# Altium schematic sheet floorctrl_power.SchDoc
size A
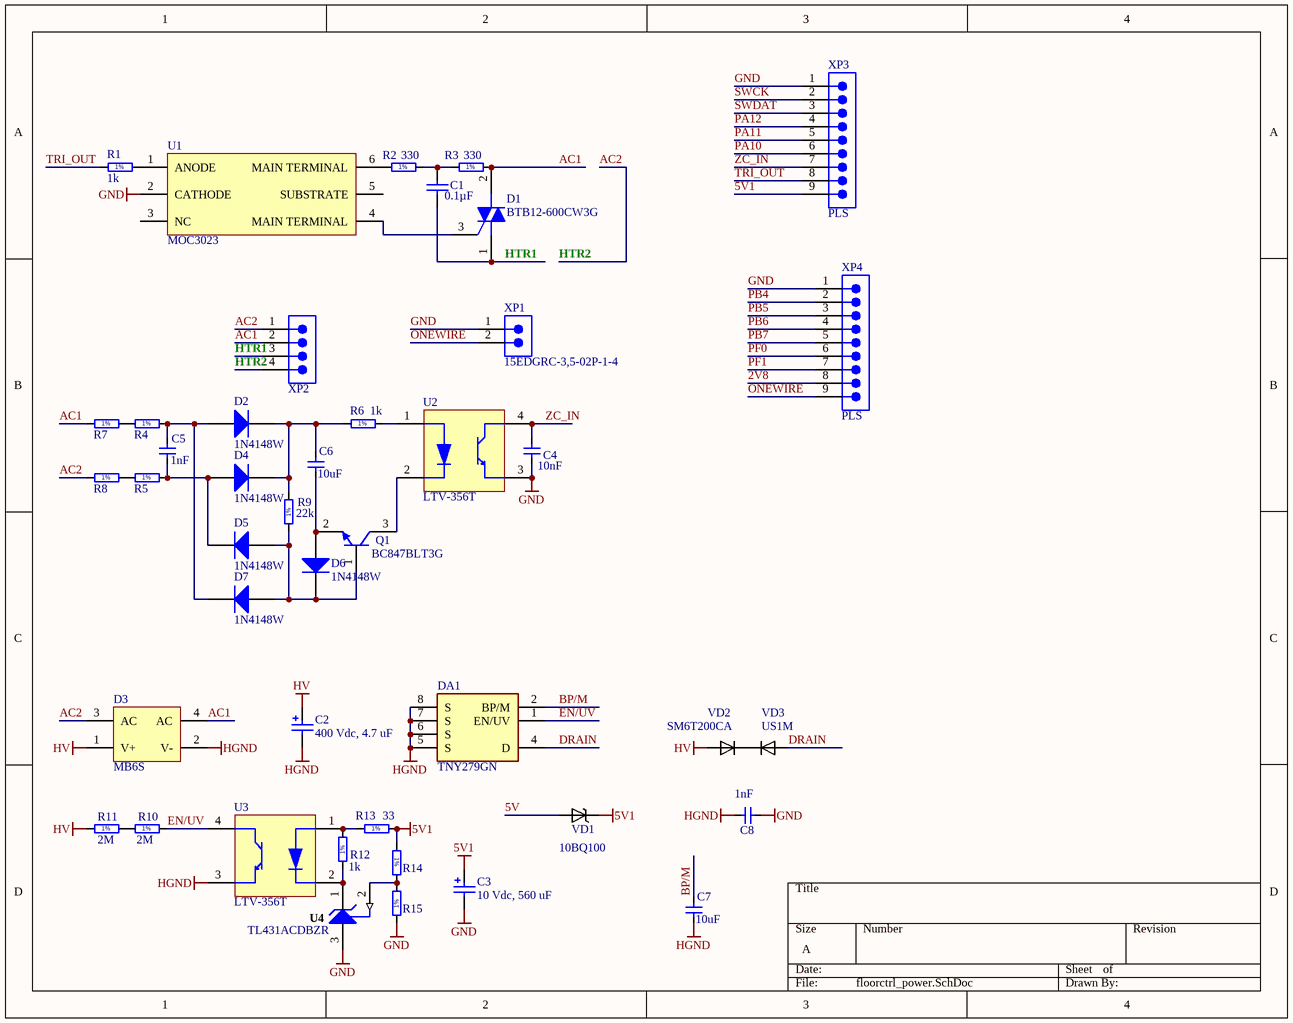
[diagram p0: floorctrl_power.SchDoc]

## Parts
C1  Capacitance: 0.1µF  [CAPA55-380X260]  (hidden comment: A104M15X7RF5TAA)
C2  400 Vdc, 4.7 uF  [WCAP-ATG8_8x11.5x3.5]
C3  10 Vdc, 560 uF  [WCAP-ATG8_8x11.5x3.5]
C4  10nF  [CAP0805R]
C5  1nF  [CAP0805R]
C6  10uF  [CAP0805R]
C7  10uF  [CAP0805R]
C8  1nF  [CAP1206R]
D1  BTB12-600CW3G  [ONSC-TO-220-3-221A-07]
D2  1N4148W  [JSCJ-SOD-123-2_V]
D3  MB6S  [FAIR-MBXS_V]
D4  1N4148W  [JSCJ-SOD-123-2_V]
D5  1N4148W  [JSCJ-SOD-123-2_V]
D6  1N4148W  [JSCJ-SOD-123-2_V]
D7  1N4148W  [JSCJ-SOD-123-2_V]
DA1  TNY279GN  [SMDIP8]
Q1  BC847BLT3G  [ONSC-SOT-23-3-318-08_V]
R1  1k  [RES0805R]
R2  330  [RES0805R]
R3  330  [RES0805R]
R4  220k  [RES1206R]  (value not drawn)
R5  220k  [RES1206R]  (value not drawn)
R6  1k  [RES0805R]
R7  220k  [RES1206R]  (value not drawn)
R8  220k  [RES1206R]  (value not drawn)
R9  22k  [RES0805R]
R10  2M  [RES1206R]
R11  2M  [RES1206R]
R12  1k  [RES0805R]
R13  33  [RES0805R]
R14  10k  [RES0805R]  (value not drawn)
R15  9k1  [RES0805R]  (value not drawn)
U1  MOC3023  [LTST-DIP-6]
U2  LTV-356T  [LTST-LTV-356T-4_V]
U3  LTV-356T  [LTST-LTV-356T-4_V]
U4  TL431ACDBZR  [DBZ0003A_L]
VD1  10BQ100  [DO-214AA]
VD2  SM6T200CA  [SMB]
VD3  US1M  [SMA]
XP1  15EDGRC-3,5-02P-1-4  [15EDGRC-3,5-02P-1-4]
XP2  15EDGRC-3.5-04P-14  [15EDGRC-3.5-04P]  (value not drawn)
XP3  PLS  [PLS-09]
XP4  PLS  [PLS-09]

## Nets
5V1: C3.1(P) R13.2 R14.1 VD1.K XP3.9
GND: C3.2(N) C4.1 C8.2 R15.1 U1.2(CATHODE) U2.3(EMITTER) U4.3(ANODE) XP1.1 XP3.1 XP4.1
HGND: C2.2(N) C7.1 C8.1 D3.2(V-) DA1.5(S) DA1.6(S) DA1.7(S) DA1.8(S) U3.3(EMITTER)
HV: C2.1(P) D3.1(V+) R11.1 VD2.A
2V8: XP4.8
5V: VD1.A
AC1: D1.2(MT2) D3.4(AC) R3.2 R7.1 XP2.2
AC2: D3.3(AC) R8.1 XP2.1 XP2.4  [also labelled HTR2]
BP/M: C7.2 DA1.2(BP/M)
DRAIN: DA1.4(D) VD3.A
EN/UV: DA1.1(EN/UV) R10.2 U3.4(COLLECTOR)
HTR1: C1.1 D1.1(MT1) XP2.3
ONEWIRE: XP1.2 XP4.9
PA10: XP3.6
PA11: XP3.5
PA12: XP3.4
PB4: XP4.2
PB5: XP4.3
PB6: XP4.4
PB7: XP4.5
PF0: XP4.6
PF1: XP4.7
SWCK: XP3.2
SWDAT: XP3.3
TRI_OUT: R1.1 XP3.8
ZC_IN: C4.2 U2.4(COLLECTOR) XP3.7
NetC1_2: C1.2 R2.2 R3.1
NetC5_1: C5.1 D4.1(+) D5.2(-) R5.2
NetC5_2: C5.2 D2.1(+) D7.2(-) R4.2
NetC6_1: C6.1 D6.1(+) Q1.2(E)
NetC6_2: C6.2 D2.2(-) D4.2(-) R6.1 R9.2
NetD1_3: D1.3(G) U1.4(MAIN_TERMINAL)
NetD5_1: D5.1(+) D6.2(-) D7.1(+) Q1.1(B) R9.1
NetQ1_3: Q1.3(C) U2.2(CATHODE)
NetR1_2: R1.2 U1.1(ANODE)
NetR2_1: R2.1 U1.6(MAIN_TERMINAL)
NetR4_1: R4.1 R7.2
NetR5_1: R5.1 R8.2
NetR6_2: R6.2 U2.1(ANODE)
NetR10_1: R10.1 R11.2
NetR12_1: R12.1 U3.2(CATHODE) U4.1(CATHODE)
NetR12_2: R12.2 R13.1 U3.1(ANODE)
NetR14_2: R14.2 R15.2 U4.2(REF)
NetVD2_K: VD2.K VD3.K

Not connected (* = marked no-connect by the designer): U1 3(NC) 5(SUBSTRATE)

## Notes on the sheet
- (in symbol R0805_1K_1%_0.125W_100PPM) 1%
- (in symbol R0805_9K1_1%_0.125W_100PPM) 1%
- (in symbol R0805_10K_1%_0.125W_100PPM) 1%
- (in symbol R0805_22K_1%_0.125W_100PPM) 1%
- (in symbol R0805_33R_1%_0.125W_100PPM) 1%
- (in symbol R0805_330R_1%_0.125W_100PPM) 1%
- (in symbol R1206_2M_1%_0.25W_100PPM) 1%
- (in symbol R1206_220K_1%_0.25W_100PPM) 1%

## Library data of the parts
C1 = CMP-2000-05716-1: Axial Leaded Multilayer Ceramic Capacitor for General Purpose, 50 VDC, 100 nF, +/- 20%, -55 to 125 degC, 2-Pin THD, RoHS, Tape and Reel; Manufacturer: Vishay; Voltage - Rated: 50V; Temperature Coefficient: X7R; Lead Spacing: -; Lead Style: -; Height - Seated (Max): -; Standard Package: 7,000; Datasheet Version: 08/2013; Datasheet URL: http://www.vishay.com/docs/45164/aseries.pdf; Package Description: 2-Pin Axial Lead, Dia 2.6 mm, Body Length 3.8 mm; Manufacturer URL: http://www.vishay.com/; Category: Capacitors; Mounting Technology: ThroughHole; Size / Dimension: 0.098"Diax0.150"L(2.50mmx3.80mm); Packaging: Tape&Reel(TR); Family: CeramicCapacitors; Applications: GeneralPurpose; Package Reference: CAPA55-380X260; Thickness (Max): -; Series: A; Features: -; Ratings: -; Mounting Type: ThroughHole; Operating Temperature: -55°C~125°C; Tolerance: ±20%; Package / Case: Axial
C2 = 860011374005: WCAP-ATG8 Aluminum Electrolytic Capacitors, 8x11.5mm, 400 Vdc, 4.7 uF; Rated Voltage: 400 Vdc; Value: 4.7 uF; ComponentLink1Description: Manufacturer; ComponentLink1URL: http://www.we-online.de; ComponentLink2Description: Datasheet; ComponentLink2URL: http://katalog.we-online.de/pbs/datasheet/860011374005.pdf; Part Number: 860011374005; Published Date: Sep. 2017; Publisher: Wurth Elektronik; Size: 8x11.5mm; Life Cycle: 2000h; Operating Temperature: -25 °C up to +85 °C
C3 = 860010274012: WCAP-ATG8 Aluminum Electrolytic Capacitors, 8x11.5mm, 10 Vdc, 560 uF; Rated Voltage: 10 Vdc; Value: 560 uF; ComponentLink1Description: Manufacturer; ComponentLink1URL: http://www.we-online.de; ComponentLink2Description: Datasheet; ComponentLink2URL: http://katalog.we-online.de/pbs/datasheet/860010274012.pdf; Part Number: 860010274012; Published Date: Sep. 2017; Publisher: Wurth Elektronik; Size: 8x11.5mm; Life Cycle: 2000h; Operating Temperature: -40 °C up to +85 °C
C4 = CC0805_10NF_250V_10%_X7R: Part Description: SMD Multilayer Chip Ceramic Capacitor; Manufacturer: GENERIC; Manufacturer1 Part Number: C0805C103KARACTU; Voltage: 250V; TC: X7R; Tolerance: ±10%; Table: Capacitors SMD; Part Number: CC0805_10NF_250V_10%_X7R; Component Kind: Standard; Component Type: Standard; Pin Count: 2; Value: 10nF; Status: None; Manufacturer Part Number: CC0805_10NF_250V_10%_X7R; Case: 0805; Mounted: Yes; Socket: No; SMD: Yes; Manufacturer1 Example: KEMET; Manufacturer1 ComponentHeight: 0.88mm; HelpURL: \\cern.ch\dfs\Applications\Altium\Datasheets\CC0805_X7R_KEMET.pdf; Author: I. Kuznetsov; CreateDate: 6/24/2013; LatestRevisionDate: 6/24/2013; Manufacturer Part Number 2: CC0805KKX7RYBB103
C5 = CC0805_1NF_50V_10%_X7R: Part Description: SMD Multilayer Chip Ceramic Capacitor; Manufacturer: GENERIC; Manufacturer1 Part Number: 223858015623; Voltage: 50V; TC: X7R; Tolerance: ±10%; Table: Capacitors SMD; Part Number: CC0805_1NF_50V_10%_X7R; Component Kind: Standard; Component Type: Standard; Pin Count: 2; Value: 1nF; Status: Preferred; Manufacturer Part Number: CC0805_1NF_50V_10%_X7R; Case: 0805; Mounted: Yes; Socket: No; SMD: Yes; Manufacturer1 Example: PHYCOMP; Manufacturer1 ComponentHeight: 1.35mm; HelpURL: \\cern.ch\dfs\Applications\Altium\Datasheets\CC0805_NP0_PHYCOMP.pdf; Author: I. Kuznetsov; CreateDate: 12/3/2007; LatestRevisionDate: 12/3/2007; Manufacturer Part Number 2: CC0805KPX7R9BB102
C6 C7 = CC0805_10UF_25V_10%_X5R: Part Description: SMD Multilayer Chip Ceramic Capacitor; Manufacturer: GENERIC; Manufacturer1 Part Number: C2012X5R1E106K125AB; Voltage: 25V; TC: X5R; Tolerance: ±10%; Table: Capacitors SMD; Part Number: CC0805_10UF_25V_10%_X5R; Component Kind: Standard; Component Type: Standard; Pin Count: 2; Value: 10uF; Status: Preferred; Manufacturer Part Number: CC0805_10UF_25V_10%_X5R; Case: 0805; Mounted: Yes; Socket: No; SMD: Yes; Manufacturer1 Example: TDK; Manufacturer1 ComponentHeight: 1.4mm; HelpURL: \\cern.ch\dfs\Applications\Altium\Datasheets\CC0805_X5R_TDK_C.pdf; Author: I. Kuznetsov; CreateDate: 10/25/2012; LatestRevisionDate: 10/25/2012; Manufacturer Part Number 2: CC0805KKX5R8BB106
C8 = CC1206_1NF_2KV_10%_X7R: Part Description: High Voltage MLC Chip Capacitor; Manufacturer: GENERIC; Manufacturer1 Part Number: 1206GC102KAT1A; Voltage: 2kV; TC: X7R; Tolerance: ±10%; Table: Capacitors SMD; Part Number: CC1206_1NF_2KV_10%_X7R; Component Kind: Standard; Component Type: Standard; Pin Count: 2; Value: 1nF; Status: None; Manufacturer Part Number: CC1206_1NF_2KV_10%_X7R; Case: 1206; Mounted: Yes; Socket: No; SMD: Yes; Manufacturer1 Example: AVX; Manufacturer1 ComponentHeight: 1.52mm; HelpURL: \\cern.ch\dfs\Applications\Altium\Datasheets\CC1206_X7R_AVX_HV-MLC.pdf; Author: I. Kuznetsov; CreateDate: 11/19/2012; LatestRevisionDate: 11/28/2013; Manufacturer Part Number 2: *
D1 = CMP-1070-00036-1: Triacs, Silicon Bidirectional Thyristor, 3-Pin TO-220, Pb-Free, Tube; Manufacturer: On Semiconductor; IT(RMS) Max (A): 12; ITSM Max (A): 120; IGT Max (mA): 35; PackageDescription: 3-Pin Flange Mount, Vertical Straight Lead, Body 9.97 x 4.445 mm, Pitch 2.54 mm; ComponentLink2Description: Datasheet; PartNumber: BTB12-600CW3G; ComponentLink2URL: http://www.onsemi.com/pub_link/Collateral/BTB12-600CW3-D.PDF; ComponentLink3Description: Package Specification; Packing: Tube; ComponentLink3URL: http://www.onsemi.com/pub_link/Collateral/221A-07.PDF; ComponentLink1Description: Manufacturer URL; Mounting Technology: Through Hole; RoHS: Pb-Free; PackageVersion: Rev. O, 07/2008; DatasheetVersion: Rev. 1; ComponentLink1URL: http://www.onsemi.com/; PackageReference: TO-220-3-221A-07
D2 D4-D7 = CMP-0914-00001-1: Fast Switching Diode, 75 V, 150 mA, 2-Pin 2.7 x 1.6 x 1.25 mm SMD, Tape and Reel; Manufacturer: Changjiang Electronics; TSTG (degC): -55 to 150; IR (uA): 1; VR (V): 75; VF (V): 1.25; PD (mW): 350; Trr (ns): 4; IO (mA): 150; Packing: Tape and Reel; ComponentLink2URL: http://www.cj-elec.com/txUpfile/20121613352740313.pdf; PackageReference: SOD-123-2; PackageVersion: Rev. A; DatasheetVersion: Rev. A; ComponentLink3Description: Package Specification; ComponentLink3URL: http://www.cj-elec.com/txUpfile/201412112231195145.pdf; ComponentLink1Description: Manufacturer URL; ComponentLink1URL: http://www.cj-elec.com/; PartNumber: 1N4148W; ComponentLink2Description: Datasheet; PackageDescription: 2-Pin SMD, Body 2.7 x 1.6 mm, Height 1.25 mm; Mounting Technology: Surface Mount
D3 = CMP-2000-06669-1: Bridge Rectifier, 0.5 A, -55 to 150 degC, 4-Pin SMD, RoHS, Tape and Reel; Manufacturer: FairchildSemiconductor; Peak Average Forward Current: 0.5@Ta=50CA; Peak Reverse Repetitive Voltage: 600V; Peak Reverse Current: 5uA; Peak Forward Voltage: 1V; Bridge Type: SinglePhase; Configuration: Single; Rad Hard: No; Manufacturer URL: https://www.fairchildsemi.com/; Category: BridgeRectifier; Packaging: Tape&Reel; Operating Temperature: -55to150°C; Package Description: 4-Pin Surface Mount Device, Body 4.725 x 3.9 mm, Pitch 2.54 mm; Package Reference: MBXS; Datasheet URL: http://www.fairchildsemi.com/datasheets/MB/MB1S.pdf; Mounting: SurfaceMount; Datasheet Version: Rev. 1.2.3, 04/2014; Mounting Technology: SurfaceMount; Package: 4SOICN
DA1 = TNY279GN: Table: Power; Part Number: TNY279GN; Device: TNY279GN
Q1 = CMP-1048-00760-1: General Purpose Transistor, NPN Silicon, 3-Pin SOT-23, Pb-Free, Tape and Reel; Manufacturer: On Semiconductor; fT Min (MHz): 100; IC Continuous (A): 0.1; Packing: Tape and Reel; ComponentLink3URL: http://www.onsemi.cn/pub_link/Collateral/318-08.PDF; PartNumber: BC847BLT3G; ComponentLink2Description: Datasheet; ComponentLink2URL: http://www.onsemi.cn/pub_link/Collateral/BC846ALT1-D.PDF; ComponentLink1URL: http://www.onsemi.com/; PackageDescription: 3-Pin Small Outline Transistor, Body 2.92 x 1.3 mm, Pitch 0.95 mm; ComponentLink3Description: Package Specification; PackageReference: SOT-23-3-318-08; RoHS: TRUE; PackageVersion: Rev. AP, 11/2009; ComponentLink1Description: Manufacturer URL; Polarity: NPN; DatasheetVersion: Rev. 11; Mounting Technology: Surface Mount
R1 R6 R12 = R0805_1K_1%_0.125W_100PPM: Part Description: General Purpose Thick Film Chip Resistor; Manufacturer: GENERIC; Manufacturer1 Part Number: NRC10F1001TRF; Power: 0.125W; TC: ±100ppm/°C; Tolerance: ±1%; Table: Resistors SMD; Part Number: R0805_1K_1%_0.125W_100PPM; Component Kind: Standard; Component Type: Standard; Footprint: RESC2012X60N; Pin Count: 2; Value: 1k; Status: Preferred; Manufacturer Part Number: R0805_1K_1%_0.125W_100PPM; Case: 0805; Mounted: Yes; Socket: No; SMD: Yes; Manufacturer1 Example: NIC COMPONENT; Manufacturer1 ComponentHeight: 0.6mm; HelpURL: \\cern.ch\dfs\Applications\Altium\Datasheets\R0805_NIC_NRC.pdf; Author: CERN DEM JLC; CreateDate: 12/3/2007; LatestRevisionDate: 3/13/2008; PackageDescription: Standard
R2 R3 = R0805_330R_1%_0.125W_100PPM: Part Description: General Purpose Thick Film Chip Resistor; Manufacturer: GENERIC; Manufacturer1 Part Number: NRC10F3300TRF; Power: 0.125W; TC: ±100ppm/°C; Tolerance: ±1%; Table: Resistors SMD; Part Number: R0805_330R_1%_0.125W_100PPM; Component Kind: Standard; Component Type: Standard; Footprint: RESC2012X60N; PackageDescription: Standard; Pin Count: 2; Value: 330; Status: Preferred; Manufacturer Part Number: R0805_330R_1%_0.125W_100PPM; Case: 0805; Mounted: Yes; Socket: No; SMD: Yes; Manufacturer1 Example: NIC COMPONENT; Manufacturer1 ComponentHeight: 0.6mm; HelpURL: \\cern.ch\dfs\Applications\Altium\Datasheets\R0805_NIC_NRC.pdf; Author: CERN DEM JLC; CreateDate: 12/3/2007; LatestRevisionDate: 3/13/2008
R4 R5 R7 R8 = R1206_220K_1%_0.25W_100PPM: Part Description: General Purpose Thick Film Chip Resistor; Manufacturer: GENERIC; Manufacturer1 Part Number: NRC12F2203TRF; Power: 0.25W; TC: ±100ppm/°C; Tolerance: ±1%; Table: Resistors SMD; Part Number: R1206_220K_1%_0.25W_100PPM; Component Kind: Standard; Component Type: Standard; Footprint: RESC3216X65N; PackageDescription: Standard; Pin Count: 2; Value: 220k; Status: Preferred; Manufacturer Part Number: R1206_220K_1%_0.25W_100PPM; Case: 1206; Mounted: Yes; Socket: No; SMD: Yes; Manufacturer1 Example: NIC COMPONENT; Manufacturer1 ComponentHeight: 0.65mm; HelpURL: \\cern.ch\dfs\Applications\Altium\Datasheets\R1206_NIC_NRC.pdf; Author: CERN DEM JLC; CreateDate: 12/3/2007; LatestRevisionDate: 3/13/2008
R9 = R0805_22K_1%_0.125W_100PPM: Part Description: General Purpose Thick Film Chip Resistor; Manufacturer: GENERIC; Manufacturer1 Part Number: NRC10F2202TRF; Power: 0.125W; TC: ±100ppm/°C; Tolerance: ±1%; Table: Resistors SMD; Part Number: R0805_22K_1%_0.125W_100PPM; Component Kind: Standard; Component Type: Standard; Footprint: RESC2012X60N; PackageDescription: Standard; Pin Count: 2; Value: 22k; Status: Preferred; Manufacturer Part Number: R0805_22K_1%_0.125W_100PPM; Case: 0805; Mounted: Yes; Socket: No; SMD: Yes; Manufacturer1 Example: NIC COMPONENT; Manufacturer1 ComponentHeight: 0.6mm; HelpURL: \\cern.ch\dfs\Applications\Altium\Datasheets\R0805_NIC_NRC.pdf; Author: CERN DEM JLC; CreateDate: 12/3/2007; LatestRevisionDate: 3/13/2008
R10 R11 = R1206_2M_1%_0.25W_100PPM: Part Description: General Purpose Thick Film Chip Resistor; Manufacturer: GENERIC; Manufacturer1 Part Number: NRC12F2004TRF; Power: 0.25W; TC: ±100ppm/°C; Tolerance: ±1%; Table: Resistors SMD; Part Number: R1206_2M_1%_0.25W_100PPM; Component Kind: Standard; Component Type: Standard; Footprint: RESC3216X65N; PackageDescription: Standard; Pin Count: 2; Value: 2M; Status: Preferred; Manufacturer Part Number: R1206_2M_1%_0.25W_100PPM; Case: 1206; Mounted: Yes; Socket: No; SMD: Yes; Manufacturer1 Example: NIC COMPONENT; Manufacturer1 ComponentHeight: 0.65mm; HelpURL: \\cern.ch\dfs\Applications\Altium\Datasheets\R1206_NIC_NRC.pdf; Author: CERN DEM JLC; CreateDate: 12/3/2007; LatestRevisionDate: 3/13/2008
R13 = R0805_33R_1%_0.125W_100PPM: Part Description: General Purpose Thick Film Chip Resistor; Manufacturer: GENERIC; Manufacturer1 Part Number: NRC10F33R0TRF; Power: 0.125W; TC: ±100ppm/°C; Tolerance: ±1%; Table: Resistors SMD; Part Number: R0805_33R_1%_0.125W_100PPM; Component Kind: Standard; Component Type: Standard; Footprint: RESC2012X60N; PackageDescription: Standard; Pin Count: 2; Value: 33; Status: Preferred; Manufacturer Part Number: R0805_33R_1%_0.125W_100PPM; Case: 0805; Mounted: Yes; Socket: No; SMD: Yes; Manufacturer1 Example: NIC COMPONENT; Manufacturer1 ComponentHeight: 0.6mm; HelpURL: \\cern.ch\dfs\Applications\Altium\Datasheets\R0805_NIC_NRC.pdf; Author: CERN DEM JLC; CreateDate: 12/3/2007; LatestRevisionDate: 3/13/2008
R14 = R0805_10K_1%_0.125W_100PPM: Part Description: General Purpose Thick Film Chip Resistor; Manufacturer: GENERIC; Manufacturer1 Part Number: NRC10F1002TRF; Power: 0.125W; TC: ±100ppm/°C; Tolerance: ±1%; Table: Resistors SMD; Part Number: R0805_10K_1%_0.125W_100PPM; Component Kind: Standard; Component Type: Standard; Footprint: RESC2012X60N; PackageDescription: Standard; Pin Count: 2; Value: 10k; Status: Preferred; Manufacturer Part Number: R0805_10K_1%_0.125W_100PPM; Case: 0805; Mounted: Yes; Socket: No; SMD: Yes; Manufacturer1 Example: NIC COMPONENT; Manufacturer1 ComponentHeight: 0.6mm; HelpURL: \\cern.ch\dfs\Applications\Altium\Datasheets\R0805_NIC_NRC.pdf; Author: CERN DEM JLC; CreateDate: 12/3/2007; LatestRevisionDate: 3/13/2008
R15 = R0805_9K1_1%_0.125W_100PPM: Part Description: General Purpose Thick Film Chip Resistor; Manufacturer: GENERIC; Manufacturer1 Part Number: NRC10F9101TRF; Power: 0.125W; TC: ±100ppm/°C; Tolerance: ±1%; Table: Resistors SMD; Part Number: R0805_9K1_1%_0.125W_100PPM; Component Kind: Standard; Component Type: Standard; Footprint: RESC2012X60N; PackageDescription: Standard; Pin Count: 2; Value: 9k1; Status: Preferred; Manufacturer Part Number: R0805_9K1_1%_0.125W_100PPM; Case: 0805; Mounted: Yes; Socket: No; SMD: Yes; Manufacturer1 Example: NIC COMPONENT; Manufacturer1 ComponentHeight: 0.6mm; HelpURL: \\cern.ch\dfs\Applications\Altium\Datasheets\R0805_NIC_NRC.pdf; Author: CERN DEM JLC; CreateDate: 12/3/2007; LatestRevisionDate: 3/13/2008
U1 = CMP-2000-06746-1: Optocoupler Triac, 50 mA, -40 to 100 degC, 6-Pin DIP, RoHS, Tube; Manufacturer: Lite-On-Inc.; Current - Hold (Ih): 400µA(Typ); Zero Crossing Circuit: Yes; Current - DC Forward (If) (Max): 50mA; Voltage - Off State: 600V; Voltage - Isolation: 5000Vrms; Approvals: CSA,FIMKO,UL; Current - LED Trigger (Ift) (Max): 5mA; Voltage - Forward (Vf) (Typ): 1.2V; Static dV/dt (Min): 1kV/µs; Number of Channels: 1; Category: Isolators; Family: Optoisolators-Triac,SCROutput; Supplier Device Package: 6-DIP; Datasheet URL: http://optoelectronics.liteon.com/upload/download/DS70-2001-026/S_110_MOC3063%20SERIES.pdf; Package Reference: DIP-6; Package / Case: 6-DIP(0.300",7.62mm); Mounting Technology: ThroughHole; Packaging: Tube; Mounting Type: ThroughHole; Operating Temperature: -40°C~100°C; Datasheet Version: Rev. C, 04/2010; Manufacturer URL: http://www.us.liteon.com/; Package Description: 6-Pin Double In-line Package, Body 7.3 x 6.5 mm, Pitch 2.54 mm; Output Type: Triac; Current - On State (It (RMS)) (Max): -; Series: -; Turn On Time: -
U2 U3 = CMP-2000-05202-1: Optocoupler DC-IN 1-CH Transistor DC-OUT 4-Pin Mini-Flat; Manufacturer: Lite-On; Maximum Collector Current: 50mA; Maximum Collector Emitter Saturation Voltage: 200mV; Product Length: 3.6mm; Number of Channels per Chip: 1; Output Type: DC; Maximum Power Dissipation: 170mW; Minimum Isolation Voltage: 3750Vrms; Pin_Count: 4; Product Width: 4.4mm; Maximum Collector Emitter Voltage: 80V; Maximum Current Transfer Ratio: 600%; Typical Forward Voltage: 1.2V; Product Height: 2mm; Maximum Reverse Voltage: 6V; Typical Rise Time: 4us; Maximum Forward Voltage: 1.4V; Typical Fall Time: 3us; Minimum Current Transfer Ratio: 50%; Maximum Fall Time: 18us; Datasheet Version: May-09; Family: LTV-356T; Product Type: TransistorandPhotovoltaicOutputPhotoCouplers; Manufacturer URL: http://www.us.liteon.com/; Output Device: Transistor; Input Type: DC; Mounting: SurfaceMount; Maximum Input Current: 50mA; Minimum Operating Temperature: -55C; Supplier_Package: (Min)i-Flat; Datasheet URL: https://datasheet.ciiva.com/16216/ltv-356t-16216247.pdf; Maximum Operating Temperature: 100C; Maximum Rise Time: 18us
U4 = CMP-0366-01028-2: Adjustable Precision Shunt Regulator, 34 ppm / degC, 100 mA, 0 to 70 degC, 3-pin SOT-23 (DBZ), Green (RoHS & no Sb/Br); Manufacturer: Texas Instruments; Min Iz for Regulation(uA): 600; Rating: Catalog; Initial Accuracy @ 25/deg C(%): 1; VO Adj(Min)(V): 2.495; Temp Coeff(Typ)(ppm/ degree C): 34; VO Adj(Max)(V): 36; Iout/Iz(Max)(mA): 100; SubFamily: Shunt Voltage Reference; PartNumber: TL431ACDBZR; PackageReference: DBZ0003A; ComponentLink1URL: http://www.ti.com/; Mounting Technology: Surface Mount; ComponentLink2Description: Datasheet; ComponentLink3URL: http://www.ti.com/litv/pdf/mpds108a; ComponentLink2URL: http://www.ti.com/general/docs/lit/getliterature.tsp?genericPartNumber=TL431A&fileType=pdf; PackageVersion: 4203227/B; Code_JEDEC: TO-236; PackageDescription: 3-Pin Plastic Small Outline, Body 2.92 x 1.3 mm, Pitch 0.95 mm; DatasheetVersion: SLVS543M; Eco-Plan: Green (RoHS & no Sb/Br); ComponentLink1Description: Manufacturer URL; ComponentLink3Description: Package Specification
VD1 = 10BQ100: Table: Diode; Part Number: 10BQ100; Device: 10BQ100
VD2 = SM6T200CA: Table: Diode; Part Number: SM6T200CA; Device: SM6T200CA
VD3 = US1M: Table: Diode; Part Number: US1M; Device: US1M
XP1 = 15EDGRC-3,5-02P-1-4: Table: DEGSON; Part Number: 15EDGRC-3,5-02P-1-4; Component Kind: Standard; Component Type: Standard; Pin Count: 2; Case: 15EDGRC-3,5-02P-1-4; Family: 15EDGRC; Mounted: Yes; Socket: No; SMD: No; Status: Active; Device: 15EDGRC-3,5-02P-1-4; ComponentLink1URL: http://files.xn--e1agecchai.xn--p1ai/pdf/15edgrc-3.5.pdf
XP2 = 15EDGRC-3.65-04P-14: Table: DEGSON; Part Number: 15EDGRC-3.65-04P-14; Component Kind: Standard; Component Type: Standard; Footprint: 15EDGRC-3.5-04P-14; Pin Count: 4; Case: 15EDGRC-3.5-04P-14; Family: 15EDGRC; Mounted: Yes; Socket: No; SMD: No; Status: Active; Device: 15EDGRC-3.5-04P-14; ComponentLink1URL: http://files.xn--e1agecchai.xn--p1ai/pdf/15edgrc-3.5.pdf
XP3 XP4 = PLS-09: Manufacturer: AUK; Part Number: PLS-09; Component Kind: Standard; Component Type: Standard; PackageDescription: PLS-09; Pin Count: 9; Family: PLS; SMD: Yes; Device: PLS-09; Manufacturer Part Number: PLS-09; ComponentLink1URL: http://lib.chipdip.ru/227/DOC000227157.pdf; Table: AUK